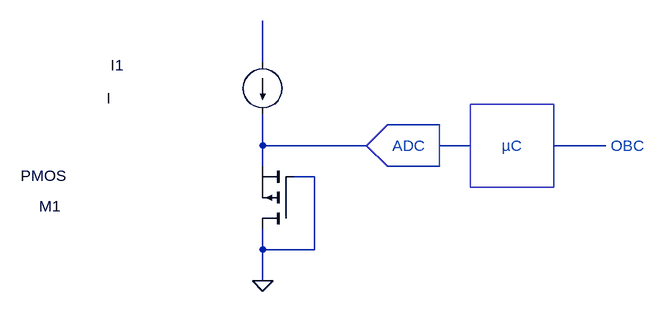
[diagram p0: schematic conceptual_block_diagram.asc]
conceptual_block_diagram.asc, the LTspice schematic file:
Version 4
SHEET 1 880 680
WIRE 16 16 16 -48
WIRE 288 112 208 112
WIRE 16 144 16 96
WIRE 176 144 16 144
WIRE 336 144 288 144
WIRE 544 144 464 144
WIRE 16 176 16 144
WIRE 288 176 208 176
WIRE 96 192 64 192
WIRE 16 304 16 272
WIRE 96 304 96 192
WIRE 96 304 16 304
WIRE 16 352 16 304
FLAG 16 352 0
SYMBOL pmos 64 272 R180
WINDOW 0 358 35 Left 2
WINDOW 3 350 82 Left 2
SYMATTR InstName M1
SYMBOL current 16 16 R0
WINDOW 0 -234 4 Left 2
WINDOW 3 -240 55 Left 2
SYMATTR InstName I1
TEXT 216 144 Left 2 ;ADC
TEXT 384 144 Left 2 ;µC
TEXT 552 144 Left 2 ;OBC
LINE Normal 288 176 288 112
LINE Normal 208 112 176 144
LINE Normal 176 144 208 176
RECTANGLE Normal 464 208 336 80

The netlist it stands for:
* conceptual_block_diagram.asc
M1 0 0 N003 N003 PMOS
I1 N001 N003 I
.model NMOS NMOS
.model PMOS PMOS
.lib standard.mos
* ADC
* µC
* OBC
.backanno
.end